# Altium schematic sheet mic.SchDoc
size A4
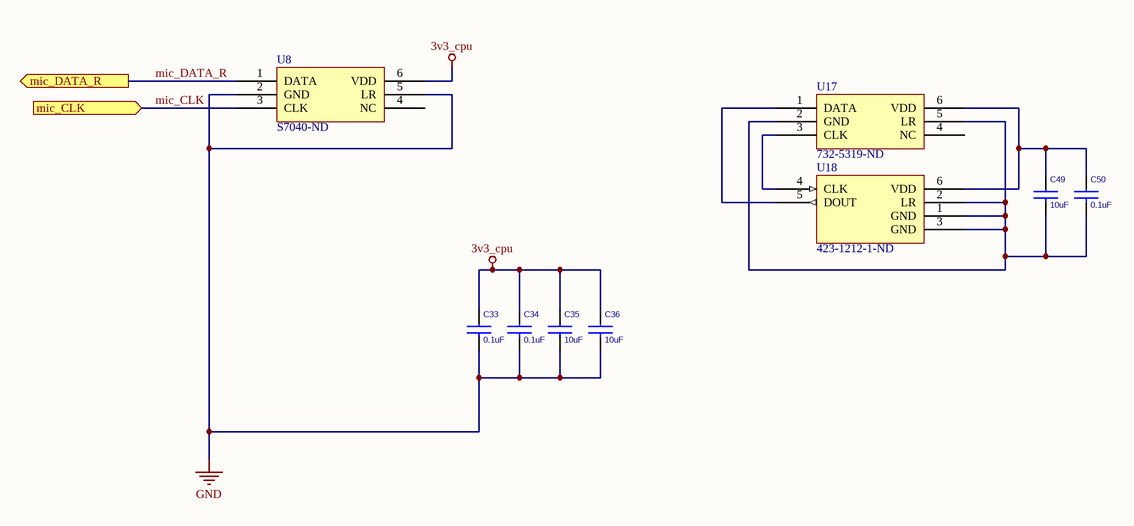
[diagram p0: mic.SchDoc]

## Parts
C33  0.1uF  [CAPC2012X09M]
C34  0.1uF  [CAPC2012X09M]
C35  10uF  [CAPC2012X09M]
C36  10uF  [CAPC2012X09M]
C49  10uF  [CAPC2012X09M]
C50  0.1uF  [CAPC2012X09M]
U8  Supplier Part Number 1: S7040-ND  [STEVAL-MKI129V1]  (hidden comment: STEVAL-MKI129V1-MOUNT-MAMA)
U17  Supplier Part Number 1: 732-5319-ND  [STEVAL-MKI129V1]  (hidden comment: STEVAL-MKI129V1-MOUNT-PAPA)
U18  Supplier Part Number 1: 423-1212-1-ND  [LGA6C165P2X3_376X472X125]  (hidden comment: SPM1437HM4H-B)

## Ports
mic_CLK (in), mic_DATA_R (out)

## Nets
3v3_cpu: C33.1 C34.1 C35.1 C36.1 U8.6(VDD)
GND: C33.2 C34.2 C35.2 C36.2 U8.2(GND) U8.5(LR)
mic_CLK: U8.3(CLK) ; port mic_CLK
mic_DATA_R: U8.1(DATA) ; port mic_DATA_R
NetC49_1: C49.1 C50.1 U17.6(VDD) U18.6(VDD)
NetC49_2: C49.2 C50.2 U17.2(GND) U17.5(LR) U18.1(GND) U18.2(LR) U18.3(GND)
NetU17_1: U17.1(DATA) U18.5(DOUT)
NetU17_3: U17.3(CLK) U18.4(CLK)

Not connected (* = marked no-connect by the designer): U8 4(NC); U17 4(NC)

## Library data of the parts
C33 C34 C50 = CAP_SMD_0.1UF_10%: CAP CER 0.1UF 25V 10% X7R 0805; Value: 0.1uF; Supplier 1: Digi-Key; Supplier Part Number 1: 399-1168-6-ND
C35 C36 C49 = CAP_SMD_10UF_20%: CAP CER 10UF 16V 20% X5R 0805; Value: 10uF; Supplier 1: Digi-Key; Supplier Part Number 1: 399-8013-1-ND
U8 = STEVAL-MKI129V1-MOUNT-MAMA: Supplier 1: Digi-Key
U17 = STEVAL-MKI129V1-MOUNT-PAPA: Supplier 1: Digi-Key
U18 = SPM1437HM4H-B: Supplier 1: Digi-Key